# Altium schematic sheet main.SchDoc
size A4
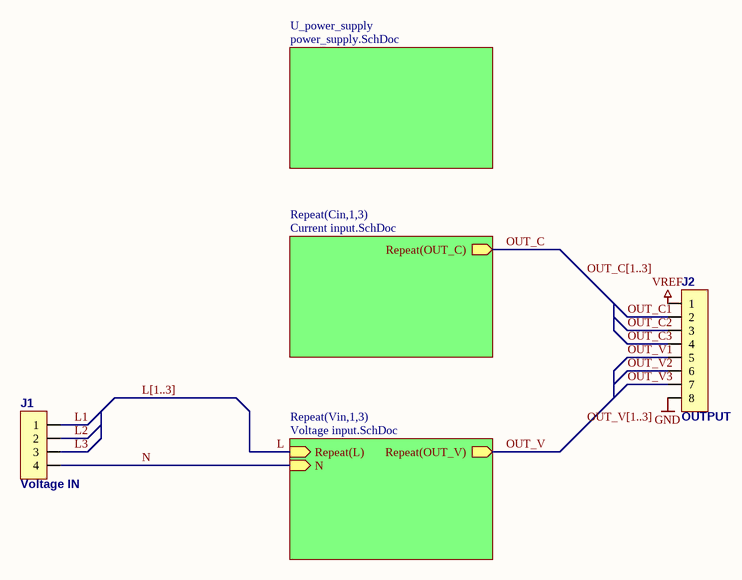
[diagram p0: main.SchDoc]

## Parts
J1  Voltage IN  [2EDGRC-5.0-4P_WO_CN]
J2  OUTPUT  [GP_8x1]

## Sub-sheets
Repeat(Cin,1,3) = Current input.SchDoc: Repeat(OUT_C) (out)
Repeat(Vin,1,3) = Voltage input.SchDoc: Repeat(L) (in), N (in), Repeat(OUT_V) (out)
U_power_supply = power_supply.SchDoc: no entries

## Nets
GND: J2.8
VREF: J2.1
L: sheet Repeat(Vin,1,3)/Repeat(L)
L1: J1.1
L2: J1.2
L3: J1.3
N: J1.4 ; sheet Repeat(Vin,1,3)/N
OUT_C: sheet Repeat(Cin,1,3)/Repeat(OUT_C)
OUT_C1: J2.2
OUT_C2: J2.3
OUT_C3: J2.4
OUT_V: sheet Repeat(Vin,1,3)/Repeat(OUT_V)
OUT_V1: J2.5
OUT_V2: J2.6
OUT_V3: J2.7

## Buses and harness runs
bus L[1..3]
bus OUT_C[1..3]
bus OUT_V[1..3]

## Library data of the parts
J1 = 2EDGRC-5.0-4P: Degson 20A, 320V, 4 Pole Plug-in Terminal Block
J2 = CN_8x1